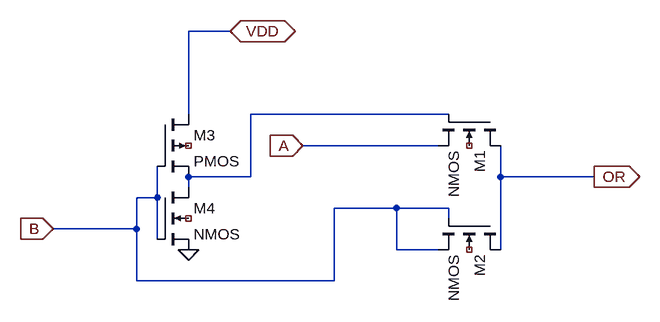
[diagram p0: schematic OR_PASS_VDD.asc]
OR_PASS_VDD.asc, the LTspice schematic file:
Version 4
SHEET 1 880 680
WIRE 144 -80 80 -80
WIRE 80 48 80 -80
WIRE 480 48 176 48
WIRE 464 96 256 96
WIRE 176 144 176 48
WIRE 176 144 80 144
WIRE 560 144 560 96
WIRE 704 144 560 144
WIRE 80 160 80 144
WIRE 32 176 32 128
WIRE 32 176 0 176
WIRE 400 192 304 192
WIRE 480 192 400 192
WIRE 480 208 480 192
WIRE 0 224 0 176
WIRE 0 224 -128 224
WIRE 32 240 32 176
WIRE 400 256 400 192
WIRE 464 256 400 256
WIRE 560 256 560 144
WIRE 0 304 0 224
WIRE 304 304 304 192
WIRE 304 304 0 304
FLAG 704 144 OR
IOPIN 704 144 Out
FLAG 256 96 A
IOPIN 256 96 In
FLAG -128 224 B
IOPIN -128 224 In
FLAG 80 256 0
FLAG 144 -80 VDD
IOPIN 144 -80 BiDir
SYMBOL nmos4 560 48 R90
SYMATTR InstName M1
SYMBOL nmos4 560 208 R90
SYMATTR InstName M2
SYMBOL pmos4 32 48 R0
SYMATTR InstName M3
SYMBOL nmos4 32 160 R0
SYMATTR InstName M4

The netlist it stands for:
* OR_PASS_VDD.asc
M1 OR N001 A NC_01 NMOS
M2 OR B B NC_02 NMOS
M3 VDD B N001 NC_03 PMOS
M4 N001 B 0 NC_04 NMOS
.model NMOS NMOS
.model PMOS PMOS
.lib standard.mos
.backanno
.end